# Altium schematic sheet Auxillary Supply Break Out.SchDoc
size A2
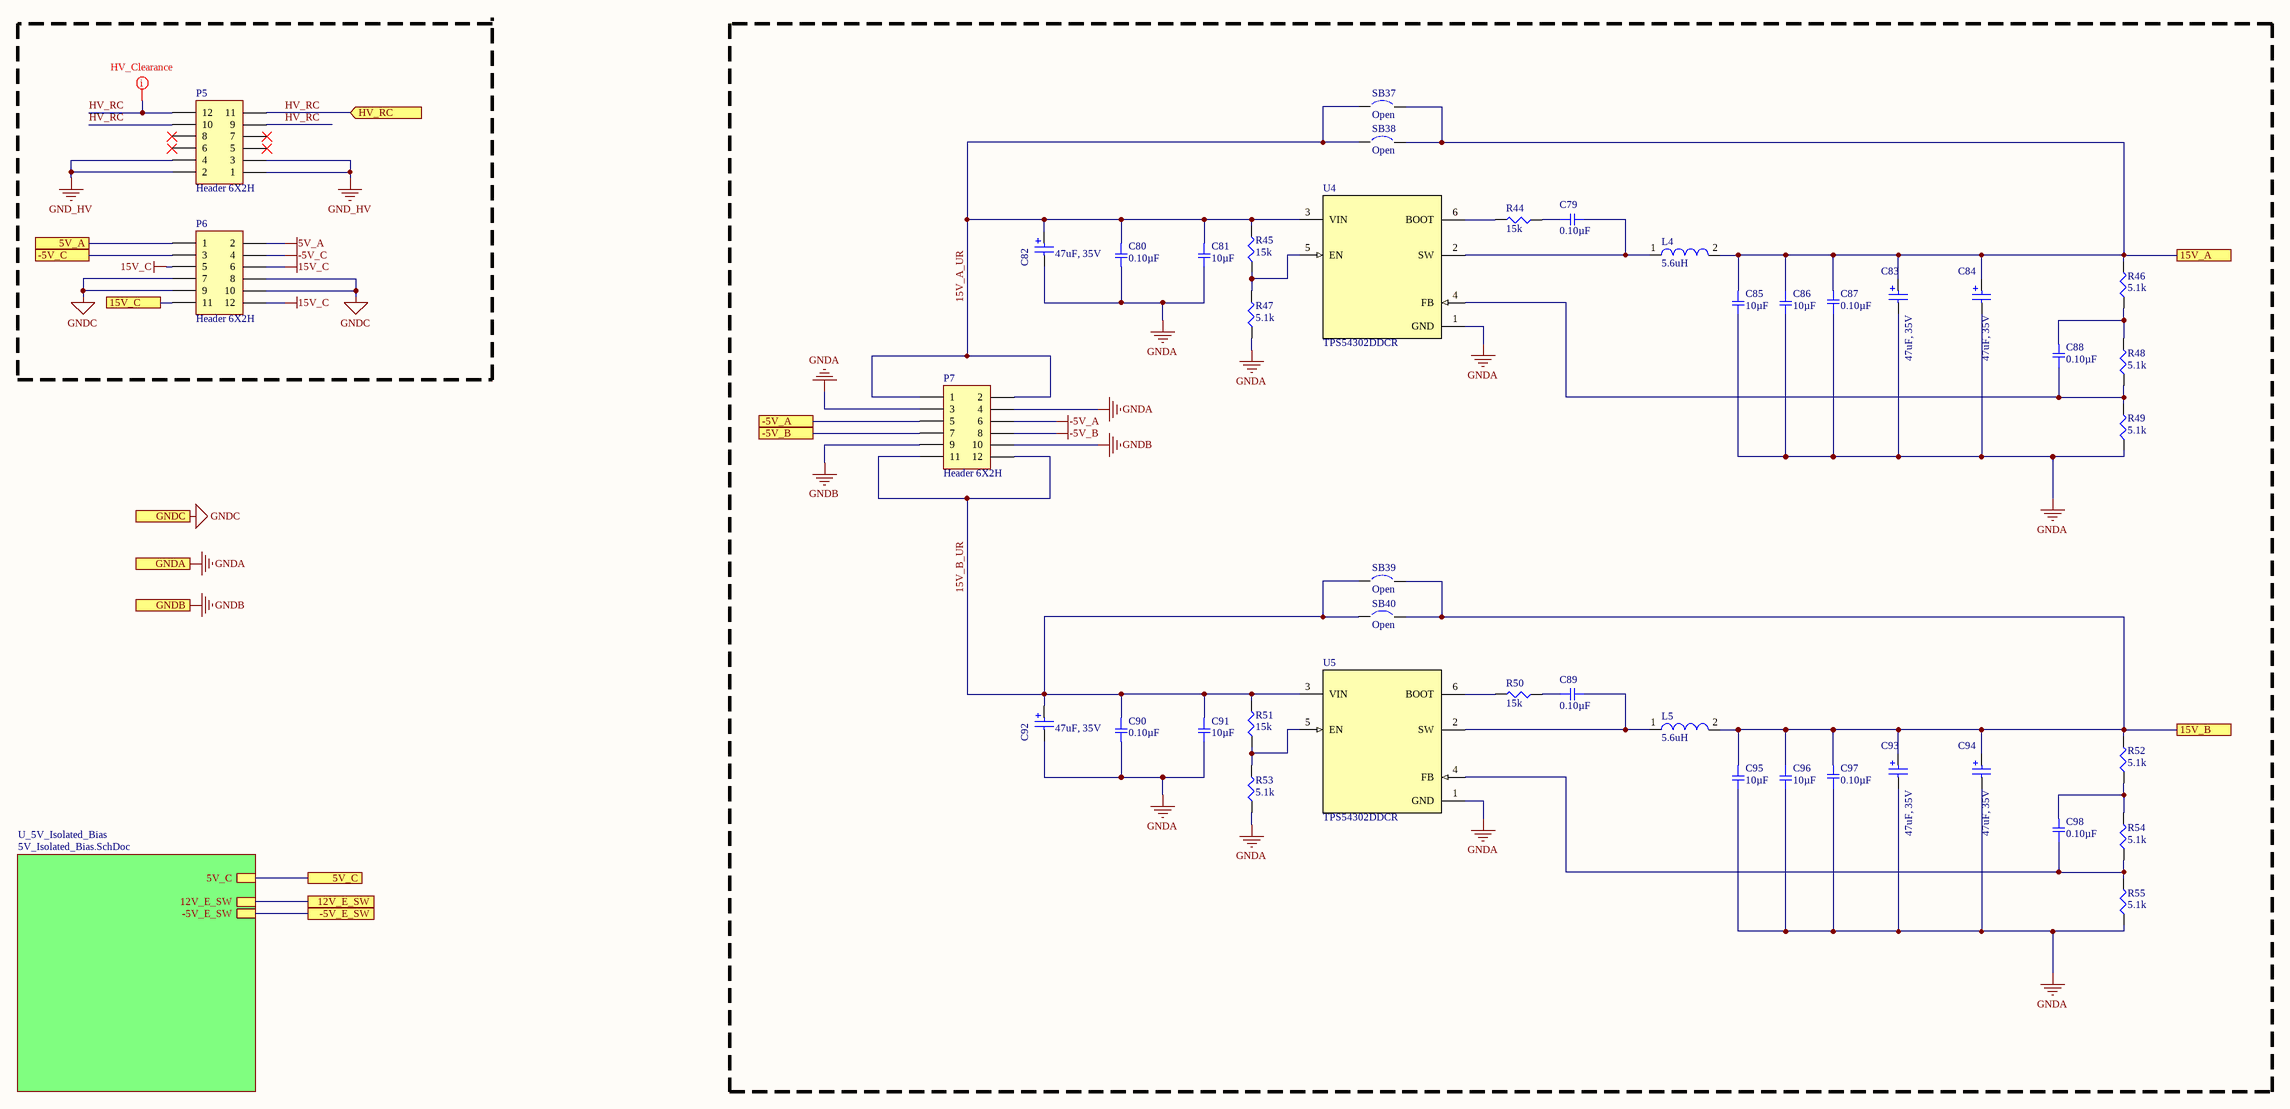
[diagram p0: Auxillary Supply Break Out.SchDoc]

## Parts
C79  0.10µF  [SMD-0805C]
C80  0.10µF  [SMD-0805C]
C81  10µF  [SMD-0805C]
C82  47uF, 35V  [WCAP-ASLU_6.3x7.7]
C83  47uF, 35V  [WCAP-ASLU_6.3x7.7]
C84  47uF, 35V  [WCAP-ASLU_6.3x7.7]
C85  10µF  [SMD-0805C]
C86  10µF  [SMD-0805C]
C87  0.10µF  [SMD-0805C]
C88  0.10µF  [SMD-0805C]
C89  0.10µF  [SMD-0805C]
C90  0.10µF  [SMD-0805C]
C91  10µF  [SMD-0805C]
C92  47uF, 35V  [WCAP-ASLU_6.3x7.7]
C93  47uF, 35V  [WCAP-ASLU_6.3x7.7]
C94  47uF, 35V  [WCAP-ASLU_6.3x7.7]
C95  10µF  [SMD-0805C]
C96  10µF  [SMD-0805C]
C97  0.10µF  [SMD-0805C]
C98  0.10µF  [SMD-0805C]
L4  5.6uH  [WE-PD-L]
L5  5.6uH  [WE-PD-L]
P5  Header 6X2H  [Stackable-Conn]
P6  Header 6X2H  [Stackable-Conn]
P7  Header 6X2H  [Stackable-Conn]
R44  15k  [SMD-0603-RES]
R45  15k  [SMD-0603-RES]
R46  5.1k  [SMD-0603-RES]
R47  5.1k  [SMD-0603-RES]
R48  5.1k  [SMD-0603-RES]
R49  5.1k  [SMD-0603-RES]
R50  15k  [SMD-0603-RES]
R51  15k  [SMD-0603-RES]
R52  5.1k  [SMD-0603-RES]
R53  5.1k  [SMD-0603-RES]
R54  5.1k  [SMD-0603-RES]
R55  5.1k  [SMD-0603-RES]
SB37  Open  [Solder Bridge - HP]  (no BOM)
SB38  Open  [Solder Bridge - HP]  (no BOM)
SB39  Open  [Solder Bridge - HP]  (no BOM)
SB40  Open  [Solder Bridge - HP]  (no BOM)
U4  TPS54302DDCR  [SOT95P278X110-6N]
U5  TPS54302DDCR  [SOT95P278X110-6N]

## Sub-sheets
U_5V_Isolated_Bias = 5V_Isolated_Bias.SchDoc: -5V_E_SW, 12V_E_SW, 5V_C

## Ports
5V_A, 5V_C, 12V_E_SW, 15V_A, 15V_B, 15V_C, -5V_A, -5V_B, -5V_C, -5V_E_SW, GNDA, GNDB, GNDC, HV_RC (in)

## Nets
5V_A: P6.2
15V_C: P6.5 P6.6 P6.12
-5V_A: P7.6
-5V_B: P7.8
-5V_C: P6.4
GND_HV: P5.1 P5.2 P5.3 P5.4
GNDA: C80.2 C81.2 C82.1(N) C83.1(N) C84.1(N) C85.2 C86.2 C87.1 C90.2 C91.2 C92.1(N) C93.1(N) C94.1(N) C95.2 C96.2 C97.1 P7.3 P7.4 R47.1 R49.1 R53.1 R55.1 U4.1(GND) U5.1(GND) ; port GNDA
GNDB: P7.9 P7.10 ; port GNDB
GNDC: P6.7 P6.8 P6.9 P6.10 ; port GNDC
5V_A: P6.1 ; port 5V_A  [a separate net that carries the same name]
5V_C: port 5V_C, sheet U_5V_Isolated_Bias/5V_C
12V_E_SW: port 12V_E_SW, sheet U_5V_Isolated_Bias/12V_E_SW
15V_A: C83.2(P) C84.2(P) C85.1 C86.1 C87.2 L4.2 R46.2 SB37.2 SB38.2 ; port 15V_A
15V_A_UR: C80.1 C81.1 C82.2(P) P7.1 P7.2 R45.2 SB37.1 SB38.1 U4.3(VIN)
15V_B: C93.2(P) C94.2(P) C95.1 C96.1 C97.2 L5.2 R52.2 SB39.2 SB40.2 ; port 15V_B
15V_B_UR: C90.1 C91.1 C92.2(P) P7.11 P7.12 R51.2 SB39.1 SB40.1 U5.3(VIN)
15V_C: P6.11 ; port 15V_C  [a separate net that carries the same name]
-5V_A: P7.5 ; port -5V_A  [a separate net that carries the same name]
-5V_B: P7.7 ; port -5V_B  [a separate net that carries the same name]
-5V_C: P6.3 ; port -5V_C  [a separate net that carries the same name]
-5V_E_SW: port -5V_E_SW, sheet U_5V_Isolated_Bias/-5V_E_SW
HV_RC: P5.9 P5.10 P5.11 P5.12 ; port HV_RC
NetC79_1: C79.1 R44.1
NetC79_2: C79.2 L4.1 U4.2(SW)
NetC88_1: C88.1 R48.1 R49.2 U4.4(FB)
NetC88_2: C88.2 R46.1 R48.2
NetC89_1: C89.1 R50.1
NetC89_2: C89.2 L5.1 U5.2(SW)
NetC98_1: C98.1 R54.1 R55.2 U5.4(FB)
NetC98_2: C98.2 R52.1 R54.2
NetR44_2: R44.2 U4.6(BOOT)
NetR45_1: R45.1 R47.2 U4.5(EN)
NetR50_2: R50.2 U5.6(BOOT)
NetR51_1: R51.1 R53.2 U5.5(EN)

Not connected (* = marked no-connect by the designer): P5 5* 6* 7* 8*

## Layout directives
rule Clearance Constraint [Generic clearance = 50mil, and 30 value(s) for objects]: HV_RC

## Library data of the parts
C79 C80 C87-C90 C97 C98 = GCD21BR71H104KA01L: CAP CER 0.1UF 50V X7R 0805; Manufacturer: Murata Electronics North America; Factory Stock: 0; Unit Price (USD): 0.24; Minimum Quantity: 1; Tolerance: ±10%; Datasheets: http://www.murata.com/~/media/webrenewal/support/library/catalog/products/capacitor/mlcc/c03e.ashx; Image: //media.digikey.com/Renders/Murata%20Renders/0805%28GxM6%29.jpg; Digi-Key Part Number: 490-11955-1-ND; Part Number: GCD21BR71H104KA01L; Quantity Available: 157; @ qty: 0; Packaging: Cut Tape (CT); Series: GCD; Part Status: Active; Value: 0.10µF; Voltage: 50V; Temperature Coefficient: X7R; Operating Temperature: -55°C ~ 125°C; Features: -; Ratings: AEC-Q200; Applications: Automotive; Mounting Type: Surface Mount, MLCC; Package / Case: 0805 (2012 Metric); Size / Dimension: 0.079" L x 0.049" W (2.00mm x 1.25mm); Height - Seated (Max): -; Thickness (Max): 0.049" (1.25mm); Lead Spacing: -; Lead Style: -
C81 C85 C86 C91 C95 C96 = GRM219R61E106KA12D: CAP CER 10UF 25V X5R 0805; Manufacturer: Murata Electronics North America; Factory Stock: 0; Unit Price (USD): 0.24; Minimum Quantity: 1; Tolerance: ±10%; Datasheets: http://www.murata.com/~/media/webrenewal/support/library/catalog/products/capacitor/mlcc/c02e.pdf; Image: //media.digikey.com/Renders/Murata%20Renders/0805%20(2012%20Metric)%20.85mm.jpg; Digi-Key Part Number: 490-7207-1-ND; Part Number: GRM219R61E106KA12D; Quantity Available: 109571; @ qty: 0; Packaging: Cut Tape (CT); Series: GRM; Part Status: Active; Value: 10µF; Voltage: 25V; Temperature Coefficient: X5R; Operating Temperature: -55°C ~ 85°C; Features: Derating Recommended; Ratings: -; Applications: General Purpose; Mounting Type: Surface Mount, MLCC; Package / Case: 0805 (2012 Metric); Size / Dimension: 0.079" L x 0.049" W (2.01mm x 1.25mm); Height - Seated (Max): -; Thickness (Max): 0.037" (0.95mm); Lead Spacing: -; Lead Style: -
C82-C84 C92-C94 = 865090545008: WCAP-ASLU Aluminium Electrolytic Capacitors, D6.3mm x L7.7mm, 47uF, +/-20%, 35VDC; Dissipation Factor: 14%; Leakage Current: 3.29uA; Endurance: 1000h; Technical Reference: ASBD077470M035DVCTCA000; Ripple Current max.: 75mA; ComponentLink1Description: Manufacturer; ComponentLink1URL: http://www.we-online.de; ComponentLink2Description: Datasheet; ComponentLink2URL: https://katalog.we-online.com/pbs/datasheet/865090545008.pdf; Mounting Technology: SMD; Operating Temperature: -40 to +85degC; Packaging: Tape and Reel; Part Number: 865090545008; Publisher: Wurth Elektronik; Capacitance: 47uF; Diameter: 6.3mm; Length: 7.7mm; Published Date: August 2019; Rated Voltage: 35VDC; Capacitance Tolerance: +/-20%
L4 L5 = CMP-0227-00698-1: SMD-Shielded Power Inductor WE-PD, L = 4.70 µH; Inductance: 4.70 ÂµH; ComponentLink1Description: Manufacturer Link; ComponentLink2Description: Datasheet; ComponentLink2URL: http://www.we-online.de/katalog/media/pdf/744771004.pdf; PackageReference: WE-PD-L; ComponentLink1URL: http://www.we-online.com; DatasheetVersion: ver 7, Sep-2006; PackageDescription: SMD Inductor, 2-Leads, Body 12.0 x 12.0 mm; PackageVersion: 2006
P5-P7 = Header 6X2H: Header, 6-Pin, Dual row, Right Angle; LatestRevisionDate: 17-Jul-2002; LatestRevisionNote: Re-released for DXP Platform.; Publisher: Altium Limited
R44 R45 R50 R51 = ERJ-3EKF1502V: RES SMD 15K OHM 1% 1/10W 0603; Manufacturer: Panasonic Electronic Components; Factory Stock: 0; Unit Price (USD): 0.00379; @ qty: 1500; Minimum Quantity: 1; Power (Watts): 0.1W, 1/10W; Temperature Coefficient: ±100ppm/°C; Part Number: ERJ-3EKF1502V; Datasheets: http://industrial.panasonic.com/www-cgi/jvcr13pz.cgi?E+PZ+3+AOA0002+ERJ3EKF1502V+7+WW; Image: //media.digikey.com/Photos/Panasonic%20Photos/MFG_ERJ-P6W%20Series.jpg; Digi-Key Part Number: P15.0KHCT-ND; Quantity Available: 660470; Packaging: Cut Tape (CT); Series: ERJ; Part Status: Active; Value: 15k; Tolerance: ±1%; Composition: Thick Film; Features: Automotive AEC-Q200; Operating Temperature: -55°C ~ 155°C; Package / Case: 0603 (1608 Metric); Supplier Device Package: 0603; Size / Dimension: 0.063" L x 0.031" W (1.60mm x 0.80mm); Height - Seated (Max): 0.022" (0.55mm); Number of Terminations: 2; Failure Rate: -
R46-R49 R52-R55 = ERJ-3EKF5101V: RES SMD 5.1K OHM 1% 1/10W 0603; Manufacturer: Panasonic Electronic Components; Factory Stock: 0; Unit Price (USD): 0.00379; @ qty: 1500; Minimum Quantity: 1; Power (Watts): 0.1W, 1/10W; Temperature Coefficient: ±100ppm/°C; Part Number: ERJ-3EKF5101V; Datasheets: http://industrial.panasonic.com/www-cgi/jvcr13pz.cgi?E+PZ+3+AOA0002+ERJ3EKF5101V+7+WW; Image: //media.digikey.com/Photos/Panasonic%20Photos/MFG_ERJ-P6W%20Series.jpg; Digi-Key Part Number: P5.10KHCT-ND; Quantity Available: 159646; Packaging: Cut Tape (CT); Series: ERJ; Part Status: Active; Value: 5.1k; Tolerance: ±1%; Composition: Thick Film; Features: Automotive AEC-Q200; Operating Temperature: -55°C ~ 155°C; Package / Case: 0603 (1608 Metric); Supplier Device Package: 0603; Size / Dimension: 0.063" L x 0.031" W (1.60mm x 0.80mm); Height - Seated (Max): 0.022" (0.55mm); Number of Terminations: 2; Failure Rate: -
SB37-SB40 = Solder Bridge: Circuit Breaker; Published: 24-Mar-1999; Revision: July-2002: Re-released for DXP Platform.; Publisher: Altium Limited
U4 U5 = TPS54302DDCR: Imported; Manufacturer: Texas Instruments; PartNumber: TPS54302DDC; RefDes: RefDes; TYPE: TYPE; Value: Value; Manufacturer_Part_Number: TPS54302DDCR; Manufacturer_Name: Texas Instruments